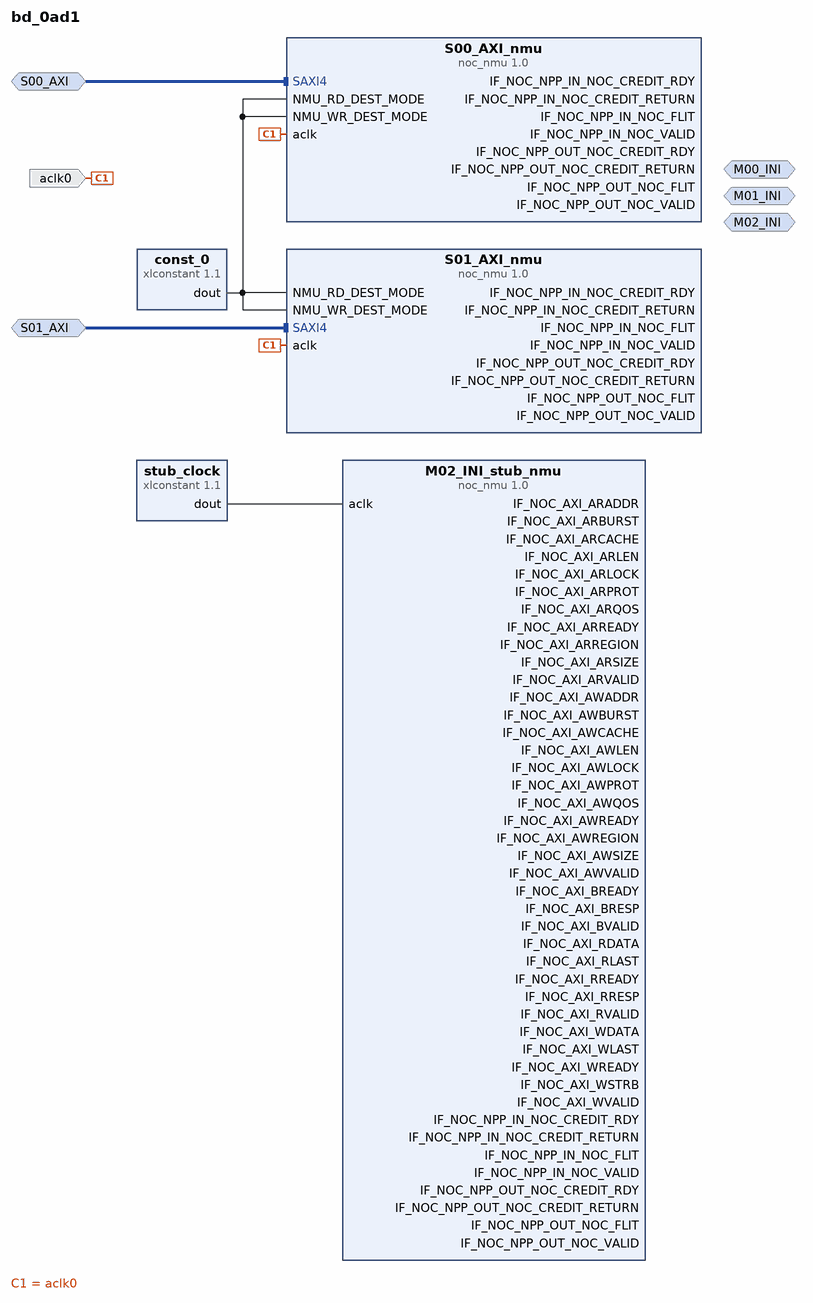
[diagram p0: block diagram of the top level]
# Vivado block design bd_0ad1, xcvc1902-vsvd1760-2MP-e-S, Vivado 2022.2.2
create_bd_design bd_0ad1

create_bd_intf_port -mode Slave -vlnv xilinx.com:interface:aximm_rtl:1.0 S00_AXI
set_property -dict [list \
  CONFIG.CATEGORY pl \
  CONFIG.CONNECTIONS {M00_INI {read_bw {819} write_bw {614} read_avg_burst {4} write_avg_burst {4}}} \
] [get_bd_intf_ports S00_AXI]
create_bd_intf_port -mode Slave -vlnv xilinx.com:interface:aximm_rtl:1.0 S01_AXI
set_property -dict [list \
  CONFIG.CATEGORY pl \
  CONFIG.CONNECTIONS {M01_INI {read_bw {778} write_bw {389} read_avg_burst {8} write_avg_burst {8}}} \
] [get_bd_intf_ports S01_AXI]
create_bd_intf_port -mode Master -vlnv xilinx.com:interface:inimm_rtl:1.0 M00_INI
set_property -dict {CONFIG.INI_STRATEGY load} [get_bd_intf_ports M00_INI]
create_bd_intf_port -mode Master -vlnv xilinx.com:interface:inimm_rtl:1.0 M01_INI
set_property -dict {CONFIG.INI_STRATEGY load} [get_bd_intf_ports M01_INI]
create_bd_intf_port -mode Master -vlnv xilinx.com:interface:inimm_rtl:1.0 M02_INI
set_property -dict {CONFIG.INI_STRATEGY load} [get_bd_intf_ports M02_INI]
create_bd_port -dir I -type clk aclk0
set_property -dict {CONFIG.ASSOCIATED_BUSIF S00_AXI:S01_AXI} [get_bd_ports aclk0]

create_bd_cell -type ip -vlnv xilinx.com:ip:noc_nmu:1.0 M02_INI_stub_nmu
set_property -dict {CONFIG.ATTR_FILE nocattrs.dat} [get_bd_cells M02_INI_stub_nmu]
create_bd_cell -type ip -vlnv xilinx.com:ip:noc_nmu:1.0 S00_AXI_nmu
set_property -dict [list \
  CONFIG.ATTR_FILE nocattrs.dat \
  CONFIG.USER_NOC_CATEGORY PL \
  CONFIG.USER_NOC_DATA512_WIDTH 128 \
  CONFIG.USER_NOC_NMU_WIDTH 512 \
] [get_bd_cells S00_AXI_nmu]
create_bd_cell -type ip -vlnv xilinx.com:ip:xlconstant:1.1 const_0
set_property -dict {CONFIG.CONST_VAL 0 CONFIG.CONST_WIDTH 1} [get_bd_cells const_0]
create_bd_cell -type ip -vlnv xilinx.com:ip:noc_nmu:1.0 S01_AXI_nmu
set_property -dict [list \
  CONFIG.ATTR_FILE nocattrs.dat \
  CONFIG.USER_NOC_CATEGORY PL \
  CONFIG.USER_NOC_DATA512_WIDTH 32 \
  CONFIG.USER_NOC_NMU_WIDTH 512 \
] [get_bd_cells S01_AXI_nmu]
create_bd_cell -type ip -vlnv xilinx.com:ip:xlconstant:1.1 stub_clock

# ---- connections ----

connect_bd_intf_net [get_bd_intf_ports S00_AXI] [get_bd_intf_pins S00_AXI_nmu/SAXI4]
connect_bd_intf_net [get_bd_intf_ports S01_AXI] [get_bd_intf_pins S01_AXI_nmu/SAXI4]
connect_bd_net -net aclk0_1 [get_bd_ports aclk0] [get_bd_pins S00_AXI_nmu/aclk] [get_bd_pins S01_AXI_nmu/aclk]
connect_bd_net [get_bd_pins const_0/dout] \
  [get_bd_pins S00_AXI_nmu/NMU_RD_DEST_MODE] [get_bd_pins S00_AXI_nmu/NMU_WR_DEST_MODE] \
  [get_bd_pins S01_AXI_nmu/NMU_RD_DEST_MODE] [get_bd_pins S01_AXI_nmu/NMU_WR_DEST_MODE]
# net m02_ini_stub_nmu_if_noc_axi_araddr has one end: M02_INI_stub_nmu/IF_NOC_AXI_ARADDR
# net m02_ini_stub_nmu_if_noc_axi_arburst has one end: M02_INI_stub_nmu/IF_NOC_AXI_ARBURST
# net m02_ini_stub_nmu_if_noc_axi_arcache has one end: M02_INI_stub_nmu/IF_NOC_AXI_ARCACHE
# net m02_ini_stub_nmu_if_noc_axi_arlen has one end: M02_INI_stub_nmu/IF_NOC_AXI_ARLEN
# net m02_ini_stub_nmu_if_noc_axi_arlock has one end: M02_INI_stub_nmu/IF_NOC_AXI_ARLOCK
# net m02_ini_stub_nmu_if_noc_axi_arprot has one end: M02_INI_stub_nmu/IF_NOC_AXI_ARPROT
# net m02_ini_stub_nmu_if_noc_axi_arqos has one end: M02_INI_stub_nmu/IF_NOC_AXI_ARQOS
# net m02_ini_stub_nmu_if_noc_axi_arready has one end: M02_INI_stub_nmu/IF_NOC_AXI_ARREADY
# net m02_ini_stub_nmu_if_noc_axi_arregion has one end: M02_INI_stub_nmu/IF_NOC_AXI_ARREGION
# net m02_ini_stub_nmu_if_noc_axi_arsize has one end: M02_INI_stub_nmu/IF_NOC_AXI_ARSIZE
# net m02_ini_stub_nmu_if_noc_axi_arvalid has one end: M02_INI_stub_nmu/IF_NOC_AXI_ARVALID
# net m02_ini_stub_nmu_if_noc_axi_awaddr has one end: M02_INI_stub_nmu/IF_NOC_AXI_AWADDR
# net m02_ini_stub_nmu_if_noc_axi_awburst has one end: M02_INI_stub_nmu/IF_NOC_AXI_AWBURST
# net m02_ini_stub_nmu_if_noc_axi_awcache has one end: M02_INI_stub_nmu/IF_NOC_AXI_AWCACHE
# net m02_ini_stub_nmu_if_noc_axi_awlen has one end: M02_INI_stub_nmu/IF_NOC_AXI_AWLEN
# net m02_ini_stub_nmu_if_noc_axi_awlock has one end: M02_INI_stub_nmu/IF_NOC_AXI_AWLOCK
# net m02_ini_stub_nmu_if_noc_axi_awprot has one end: M02_INI_stub_nmu/IF_NOC_AXI_AWPROT
# net m02_ini_stub_nmu_if_noc_axi_awqos has one end: M02_INI_stub_nmu/IF_NOC_AXI_AWQOS
# net m02_ini_stub_nmu_if_noc_axi_awready has one end: M02_INI_stub_nmu/IF_NOC_AXI_AWREADY
# net m02_ini_stub_nmu_if_noc_axi_awregion has one end: M02_INI_stub_nmu/IF_NOC_AXI_AWREGION
# net m02_ini_stub_nmu_if_noc_axi_awsize has one end: M02_INI_stub_nmu/IF_NOC_AXI_AWSIZE
# net m02_ini_stub_nmu_if_noc_axi_awvalid has one end: M02_INI_stub_nmu/IF_NOC_AXI_AWVALID
# net m02_ini_stub_nmu_if_noc_axi_bready has one end: M02_INI_stub_nmu/IF_NOC_AXI_BREADY
# net m02_ini_stub_nmu_if_noc_axi_bresp has one end: M02_INI_stub_nmu/IF_NOC_AXI_BRESP
# net m02_ini_stub_nmu_if_noc_axi_bvalid has one end: M02_INI_stub_nmu/IF_NOC_AXI_BVALID
# net m02_ini_stub_nmu_if_noc_axi_rdata has one end: M02_INI_stub_nmu/IF_NOC_AXI_RDATA
# net m02_ini_stub_nmu_if_noc_axi_rlast has one end: M02_INI_stub_nmu/IF_NOC_AXI_RLAST
# net m02_ini_stub_nmu_if_noc_axi_rready has one end: M02_INI_stub_nmu/IF_NOC_AXI_RREADY
# net m02_ini_stub_nmu_if_noc_axi_rresp has one end: M02_INI_stub_nmu/IF_NOC_AXI_RRESP
# net m02_ini_stub_nmu_if_noc_axi_rvalid has one end: M02_INI_stub_nmu/IF_NOC_AXI_RVALID
# net m02_ini_stub_nmu_if_noc_axi_wdata has one end: M02_INI_stub_nmu/IF_NOC_AXI_WDATA
# net m02_ini_stub_nmu_if_noc_axi_wlast has one end: M02_INI_stub_nmu/IF_NOC_AXI_WLAST
# net m02_ini_stub_nmu_if_noc_axi_wready has one end: M02_INI_stub_nmu/IF_NOC_AXI_WREADY
# net m02_ini_stub_nmu_if_noc_axi_wstrb has one end: M02_INI_stub_nmu/IF_NOC_AXI_WSTRB
# net m02_ini_stub_nmu_if_noc_axi_wvalid has one end: M02_INI_stub_nmu/IF_NOC_AXI_WVALID
# net m02_ini_stub_nmu_if_noc_npp_in_noc_credit_rdy has one end: M02_INI_stub_nmu/IF_NOC_NPP_IN_NOC_CREDIT_RDY
# net m02_ini_stub_nmu_if_noc_npp_in_noc_credit_return has one end: M02_INI_stub_nmu/IF_NOC_NPP_IN_NOC_CREDIT_RETURN
# net m02_ini_stub_nmu_if_noc_npp_in_noc_flit has one end: M02_INI_stub_nmu/IF_NOC_NPP_IN_NOC_FLIT
# net m02_ini_stub_nmu_if_noc_npp_in_noc_valid has one end: M02_INI_stub_nmu/IF_NOC_NPP_IN_NOC_VALID
# net m02_ini_stub_nmu_if_noc_npp_out_noc_credit_rdy has one end: M02_INI_stub_nmu/IF_NOC_NPP_OUT_NOC_CREDIT_RDY
# net m02_ini_stub_nmu_if_noc_npp_out_noc_credit_return has one end: M02_INI_stub_nmu/IF_NOC_NPP_OUT_NOC_CREDIT_RETURN
# net m02_ini_stub_nmu_if_noc_npp_out_noc_flit has one end: M02_INI_stub_nmu/IF_NOC_NPP_OUT_NOC_FLIT
# net m02_ini_stub_nmu_if_noc_npp_out_noc_valid has one end: M02_INI_stub_nmu/IF_NOC_NPP_OUT_NOC_VALID
# net s00_axi_nmu_if_noc_npp_in_noc_credit_rdy has one end: S00_AXI_nmu/IF_NOC_NPP_IN_NOC_CREDIT_RDY
# net s00_axi_nmu_if_noc_npp_in_noc_credit_return has one end: S00_AXI_nmu/IF_NOC_NPP_IN_NOC_CREDIT_RETURN
# net s00_axi_nmu_if_noc_npp_in_noc_flit has one end: S00_AXI_nmu/IF_NOC_NPP_IN_NOC_FLIT
# net s00_axi_nmu_if_noc_npp_in_noc_valid has one end: S00_AXI_nmu/IF_NOC_NPP_IN_NOC_VALID
# net s00_axi_nmu_if_noc_npp_out_noc_credit_rdy has one end: S00_AXI_nmu/IF_NOC_NPP_OUT_NOC_CREDIT_RDY
# net s00_axi_nmu_if_noc_npp_out_noc_credit_return has one end: S00_AXI_nmu/IF_NOC_NPP_OUT_NOC_CREDIT_RETURN
# net s00_axi_nmu_if_noc_npp_out_noc_flit has one end: S00_AXI_nmu/IF_NOC_NPP_OUT_NOC_FLIT
# net s00_axi_nmu_if_noc_npp_out_noc_valid has one end: S00_AXI_nmu/IF_NOC_NPP_OUT_NOC_VALID
# net s01_axi_nmu_if_noc_npp_in_noc_credit_rdy has one end: S01_AXI_nmu/IF_NOC_NPP_IN_NOC_CREDIT_RDY
# net s01_axi_nmu_if_noc_npp_in_noc_credit_return has one end: S01_AXI_nmu/IF_NOC_NPP_IN_NOC_CREDIT_RETURN
# net s01_axi_nmu_if_noc_npp_in_noc_flit has one end: S01_AXI_nmu/IF_NOC_NPP_IN_NOC_FLIT
# net s01_axi_nmu_if_noc_npp_in_noc_valid has one end: S01_AXI_nmu/IF_NOC_NPP_IN_NOC_VALID
# net s01_axi_nmu_if_noc_npp_out_noc_credit_rdy has one end: S01_AXI_nmu/IF_NOC_NPP_OUT_NOC_CREDIT_RDY
# net s01_axi_nmu_if_noc_npp_out_noc_credit_return has one end: S01_AXI_nmu/IF_NOC_NPP_OUT_NOC_CREDIT_RETURN
# net s01_axi_nmu_if_noc_npp_out_noc_flit has one end: S01_AXI_nmu/IF_NOC_NPP_OUT_NOC_FLIT
# net s01_axi_nmu_if_noc_npp_out_noc_valid has one end: S01_AXI_nmu/IF_NOC_NPP_OUT_NOC_VALID
connect_bd_net [get_bd_pins stub_clock/dout] [get_bd_pins M02_INI_stub_nmu/aclk]
set_property HDL_ATTRIBUTE.DONT_TOUCH true [get_bd_cells M02_INI_stub_nmu]
set_property HDL_ATTRIBUTE.DONT_TOUCH true [get_bd_cells S00_AXI_nmu]
set_property HDL_ATTRIBUTE.DONT_TOUCH true [get_bd_cells const_0]
set_property HDL_ATTRIBUTE.DONT_TOUCH true [get_bd_cells S01_AXI_nmu]
set_property HDL_ATTRIBUTE.DONT_TOUCH true [get_bd_cells stub_clock]
set_property HDL_ATTRIBUTE.EXT_CONN TRUE [get_bd_nets m02_ini_stub_nmu_if_noc_axi_araddr]
set_property HDL_ATTRIBUTE.HIDDEN TRUE [get_bd_nets m02_ini_stub_nmu_if_noc_axi_araddr]
set_property HDL_ATTRIBUTE.SIM_ONLY TRUE [get_bd_nets m02_ini_stub_nmu_if_noc_axi_araddr]
set_property HDL_ATTRIBUTE.EXT_CONN TRUE [get_bd_nets m02_ini_stub_nmu_if_noc_axi_arburst]
set_property HDL_ATTRIBUTE.HIDDEN TRUE [get_bd_nets m02_ini_stub_nmu_if_noc_axi_arburst]
set_property HDL_ATTRIBUTE.SIM_ONLY TRUE [get_bd_nets m02_ini_stub_nmu_if_noc_axi_arburst]
set_property HDL_ATTRIBUTE.EXT_CONN TRUE [get_bd_nets m02_ini_stub_nmu_if_noc_axi_arcache]
set_property HDL_ATTRIBUTE.HIDDEN TRUE [get_bd_nets m02_ini_stub_nmu_if_noc_axi_arcache]
set_property HDL_ATTRIBUTE.SIM_ONLY TRUE [get_bd_nets m02_ini_stub_nmu_if_noc_axi_arcache]
set_property HDL_ATTRIBUTE.EXT_CONN TRUE [get_bd_nets m02_ini_stub_nmu_if_noc_axi_arlen]
set_property HDL_ATTRIBUTE.HIDDEN TRUE [get_bd_nets m02_ini_stub_nmu_if_noc_axi_arlen]
set_property HDL_ATTRIBUTE.SIM_ONLY TRUE [get_bd_nets m02_ini_stub_nmu_if_noc_axi_arlen]
set_property HDL_ATTRIBUTE.EXT_CONN TRUE [get_bd_nets m02_ini_stub_nmu_if_noc_axi_arlock]
set_property HDL_ATTRIBUTE.HIDDEN TRUE [get_bd_nets m02_ini_stub_nmu_if_noc_axi_arlock]
set_property HDL_ATTRIBUTE.SIM_ONLY TRUE [get_bd_nets m02_ini_stub_nmu_if_noc_axi_arlock]
set_property HDL_ATTRIBUTE.EXT_CONN TRUE [get_bd_nets m02_ini_stub_nmu_if_noc_axi_arprot]
set_property HDL_ATTRIBUTE.HIDDEN TRUE [get_bd_nets m02_ini_stub_nmu_if_noc_axi_arprot]
set_property HDL_ATTRIBUTE.SIM_ONLY TRUE [get_bd_nets m02_ini_stub_nmu_if_noc_axi_arprot]
set_property HDL_ATTRIBUTE.EXT_CONN TRUE [get_bd_nets m02_ini_stub_nmu_if_noc_axi_arqos]
set_property HDL_ATTRIBUTE.HIDDEN TRUE [get_bd_nets m02_ini_stub_nmu_if_noc_axi_arqos]
set_property HDL_ATTRIBUTE.SIM_ONLY TRUE [get_bd_nets m02_ini_stub_nmu_if_noc_axi_arqos]
set_property HDL_ATTRIBUTE.EXT_CONN TRUE [get_bd_nets m02_ini_stub_nmu_if_noc_axi_arready]
set_property HDL_ATTRIBUTE.HIDDEN TRUE [get_bd_nets m02_ini_stub_nmu_if_noc_axi_arready]
set_property HDL_ATTRIBUTE.SIM_ONLY TRUE [get_bd_nets m02_ini_stub_nmu_if_noc_axi_arready]
set_property HDL_ATTRIBUTE.EXT_CONN TRUE [get_bd_nets m02_ini_stub_nmu_if_noc_axi_arregion]
set_property HDL_ATTRIBUTE.HIDDEN TRUE [get_bd_nets m02_ini_stub_nmu_if_noc_axi_arregion]
set_property HDL_ATTRIBUTE.SIM_ONLY TRUE [get_bd_nets m02_ini_stub_nmu_if_noc_axi_arregion]
set_property HDL_ATTRIBUTE.EXT_CONN TRUE [get_bd_nets m02_ini_stub_nmu_if_noc_axi_arsize]
set_property HDL_ATTRIBUTE.HIDDEN TRUE [get_bd_nets m02_ini_stub_nmu_if_noc_axi_arsize]
set_property HDL_ATTRIBUTE.SIM_ONLY TRUE [get_bd_nets m02_ini_stub_nmu_if_noc_axi_arsize]
set_property HDL_ATTRIBUTE.EXT_CONN TRUE [get_bd_nets m02_ini_stub_nmu_if_noc_axi_arvalid]
set_property HDL_ATTRIBUTE.HIDDEN TRUE [get_bd_nets m02_ini_stub_nmu_if_noc_axi_arvalid]
set_property HDL_ATTRIBUTE.SIM_ONLY TRUE [get_bd_nets m02_ini_stub_nmu_if_noc_axi_arvalid]
set_property HDL_ATTRIBUTE.EXT_CONN TRUE [get_bd_nets m02_ini_stub_nmu_if_noc_axi_awaddr]
set_property HDL_ATTRIBUTE.HIDDEN TRUE [get_bd_nets m02_ini_stub_nmu_if_noc_axi_awaddr]
set_property HDL_ATTRIBUTE.SIM_ONLY TRUE [get_bd_nets m02_ini_stub_nmu_if_noc_axi_awaddr]
set_property HDL_ATTRIBUTE.EXT_CONN TRUE [get_bd_nets m02_ini_stub_nmu_if_noc_axi_awburst]
set_property HDL_ATTRIBUTE.HIDDEN TRUE [get_bd_nets m02_ini_stub_nmu_if_noc_axi_awburst]
set_property HDL_ATTRIBUTE.SIM_ONLY TRUE [get_bd_nets m02_ini_stub_nmu_if_noc_axi_awburst]
set_property HDL_ATTRIBUTE.EXT_CONN TRUE [get_bd_nets m02_ini_stub_nmu_if_noc_axi_awcache]
set_property HDL_ATTRIBUTE.HIDDEN TRUE [get_bd_nets m02_ini_stub_nmu_if_noc_axi_awcache]
set_property HDL_ATTRIBUTE.SIM_ONLY TRUE [get_bd_nets m02_ini_stub_nmu_if_noc_axi_awcache]
set_property HDL_ATTRIBUTE.EXT_CONN TRUE [get_bd_nets m02_ini_stub_nmu_if_noc_axi_awlen]
set_property HDL_ATTRIBUTE.HIDDEN TRUE [get_bd_nets m02_ini_stub_nmu_if_noc_axi_awlen]
set_property HDL_ATTRIBUTE.SIM_ONLY TRUE [get_bd_nets m02_ini_stub_nmu_if_noc_axi_awlen]
set_property HDL_ATTRIBUTE.EXT_CONN TRUE [get_bd_nets m02_ini_stub_nmu_if_noc_axi_awlock]
set_property HDL_ATTRIBUTE.HIDDEN TRUE [get_bd_nets m02_ini_stub_nmu_if_noc_axi_awlock]
set_property HDL_ATTRIBUTE.SIM_ONLY TRUE [get_bd_nets m02_ini_stub_nmu_if_noc_axi_awlock]
set_property HDL_ATTRIBUTE.EXT_CONN TRUE [get_bd_nets m02_ini_stub_nmu_if_noc_axi_awprot]
set_property HDL_ATTRIBUTE.HIDDEN TRUE [get_bd_nets m02_ini_stub_nmu_if_noc_axi_awprot]
set_property HDL_ATTRIBUTE.SIM_ONLY TRUE [get_bd_nets m02_ini_stub_nmu_if_noc_axi_awprot]
set_property HDL_ATTRIBUTE.EXT_CONN TRUE [get_bd_nets m02_ini_stub_nmu_if_noc_axi_awqos]
set_property HDL_ATTRIBUTE.HIDDEN TRUE [get_bd_nets m02_ini_stub_nmu_if_noc_axi_awqos]
set_property HDL_ATTRIBUTE.SIM_ONLY TRUE [get_bd_nets m02_ini_stub_nmu_if_noc_axi_awqos]
set_property HDL_ATTRIBUTE.EXT_CONN TRUE [get_bd_nets m02_ini_stub_nmu_if_noc_axi_awready]
set_property HDL_ATTRIBUTE.HIDDEN TRUE [get_bd_nets m02_ini_stub_nmu_if_noc_axi_awready]
set_property HDL_ATTRIBUTE.SIM_ONLY TRUE [get_bd_nets m02_ini_stub_nmu_if_noc_axi_awready]
set_property HDL_ATTRIBUTE.EXT_CONN TRUE [get_bd_nets m02_ini_stub_nmu_if_noc_axi_awregion]
set_property HDL_ATTRIBUTE.HIDDEN TRUE [get_bd_nets m02_ini_stub_nmu_if_noc_axi_awregion]
set_property HDL_ATTRIBUTE.SIM_ONLY TRUE [get_bd_nets m02_ini_stub_nmu_if_noc_axi_awregion]
set_property HDL_ATTRIBUTE.EXT_CONN TRUE [get_bd_nets m02_ini_stub_nmu_if_noc_axi_awsize]
set_property HDL_ATTRIBUTE.HIDDEN TRUE [get_bd_nets m02_ini_stub_nmu_if_noc_axi_awsize]
set_property HDL_ATTRIBUTE.SIM_ONLY TRUE [get_bd_nets m02_ini_stub_nmu_if_noc_axi_awsize]
set_property HDL_ATTRIBUTE.EXT_CONN TRUE [get_bd_nets m02_ini_stub_nmu_if_noc_axi_awvalid]
set_property HDL_ATTRIBUTE.HIDDEN TRUE [get_bd_nets m02_ini_stub_nmu_if_noc_axi_awvalid]
set_property HDL_ATTRIBUTE.SIM_ONLY TRUE [get_bd_nets m02_ini_stub_nmu_if_noc_axi_awvalid]
set_property HDL_ATTRIBUTE.EXT_CONN TRUE [get_bd_nets m02_ini_stub_nmu_if_noc_axi_bready]
set_property HDL_ATTRIBUTE.HIDDEN TRUE [get_bd_nets m02_ini_stub_nmu_if_noc_axi_bready]
set_property HDL_ATTRIBUTE.SIM_ONLY TRUE [get_bd_nets m02_ini_stub_nmu_if_noc_axi_bready]
set_property HDL_ATTRIBUTE.EXT_CONN TRUE [get_bd_nets m02_ini_stub_nmu_if_noc_axi_bresp]
set_property HDL_ATTRIBUTE.HIDDEN TRUE [get_bd_nets m02_ini_stub_nmu_if_noc_axi_bresp]
set_property HDL_ATTRIBUTE.SIM_ONLY TRUE [get_bd_nets m02_ini_stub_nmu_if_noc_axi_bresp]
set_property HDL_ATTRIBUTE.EXT_CONN TRUE [get_bd_nets m02_ini_stub_nmu_if_noc_axi_bvalid]
set_property HDL_ATTRIBUTE.HIDDEN TRUE [get_bd_nets m02_ini_stub_nmu_if_noc_axi_bvalid]
set_property HDL_ATTRIBUTE.SIM_ONLY TRUE [get_bd_nets m02_ini_stub_nmu_if_noc_axi_bvalid]
set_property HDL_ATTRIBUTE.EXT_CONN TRUE [get_bd_nets m02_ini_stub_nmu_if_noc_axi_rdata]
set_property HDL_ATTRIBUTE.HIDDEN TRUE [get_bd_nets m02_ini_stub_nmu_if_noc_axi_rdata]
set_property HDL_ATTRIBUTE.SIM_ONLY TRUE [get_bd_nets m02_ini_stub_nmu_if_noc_axi_rdata]
set_property HDL_ATTRIBUTE.EXT_CONN TRUE [get_bd_nets m02_ini_stub_nmu_if_noc_axi_rlast]
set_property HDL_ATTRIBUTE.HIDDEN TRUE [get_bd_nets m02_ini_stub_nmu_if_noc_axi_rlast]
set_property HDL_ATTRIBUTE.SIM_ONLY TRUE [get_bd_nets m02_ini_stub_nmu_if_noc_axi_rlast]
set_property HDL_ATTRIBUTE.EXT_CONN TRUE [get_bd_nets m02_ini_stub_nmu_if_noc_axi_rready]
set_property HDL_ATTRIBUTE.HIDDEN TRUE [get_bd_nets m02_ini_stub_nmu_if_noc_axi_rready]
set_property HDL_ATTRIBUTE.SIM_ONLY TRUE [get_bd_nets m02_ini_stub_nmu_if_noc_axi_rready]
set_property HDL_ATTRIBUTE.EXT_CONN TRUE [get_bd_nets m02_ini_stub_nmu_if_noc_axi_rresp]
set_property HDL_ATTRIBUTE.HIDDEN TRUE [get_bd_nets m02_ini_stub_nmu_if_noc_axi_rresp]
set_property HDL_ATTRIBUTE.SIM_ONLY TRUE [get_bd_nets m02_ini_stub_nmu_if_noc_axi_rresp]
set_property HDL_ATTRIBUTE.EXT_CONN TRUE [get_bd_nets m02_ini_stub_nmu_if_noc_axi_rvalid]
set_property HDL_ATTRIBUTE.HIDDEN TRUE [get_bd_nets m02_ini_stub_nmu_if_noc_axi_rvalid]
set_property HDL_ATTRIBUTE.SIM_ONLY TRUE [get_bd_nets m02_ini_stub_nmu_if_noc_axi_rvalid]
set_property HDL_ATTRIBUTE.EXT_CONN TRUE [get_bd_nets m02_ini_stub_nmu_if_noc_axi_wdata]
set_property HDL_ATTRIBUTE.HIDDEN TRUE [get_bd_nets m02_ini_stub_nmu_if_noc_axi_wdata]
set_property HDL_ATTRIBUTE.SIM_ONLY TRUE [get_bd_nets m02_ini_stub_nmu_if_noc_axi_wdata]
set_property HDL_ATTRIBUTE.EXT_CONN TRUE [get_bd_nets m02_ini_stub_nmu_if_noc_axi_wlast]
set_property HDL_ATTRIBUTE.HIDDEN TRUE [get_bd_nets m02_ini_stub_nmu_if_noc_axi_wlast]
set_property HDL_ATTRIBUTE.SIM_ONLY TRUE [get_bd_nets m02_ini_stub_nmu_if_noc_axi_wlast]
set_property HDL_ATTRIBUTE.EXT_CONN TRUE [get_bd_nets m02_ini_stub_nmu_if_noc_axi_wready]
set_property HDL_ATTRIBUTE.HIDDEN TRUE [get_bd_nets m02_ini_stub_nmu_if_noc_axi_wready]
set_property HDL_ATTRIBUTE.SIM_ONLY TRUE [get_bd_nets m02_ini_stub_nmu_if_noc_axi_wready]
set_property HDL_ATTRIBUTE.EXT_CONN TRUE [get_bd_nets m02_ini_stub_nmu_if_noc_axi_wstrb]
set_property HDL_ATTRIBUTE.HIDDEN TRUE [get_bd_nets m02_ini_stub_nmu_if_noc_axi_wstrb]
set_property HDL_ATTRIBUTE.SIM_ONLY TRUE [get_bd_nets m02_ini_stub_nmu_if_noc_axi_wstrb]
set_property HDL_ATTRIBUTE.EXT_CONN TRUE [get_bd_nets m02_ini_stub_nmu_if_noc_axi_wvalid]
set_property HDL_ATTRIBUTE.HIDDEN TRUE [get_bd_nets m02_ini_stub_nmu_if_noc_axi_wvalid]
set_property HDL_ATTRIBUTE.SIM_ONLY TRUE [get_bd_nets m02_ini_stub_nmu_if_noc_axi_wvalid]
set_property HDL_ATTRIBUTE.EXT_CONN TRUE [get_bd_nets m02_ini_stub_nmu_if_noc_npp_in_noc_credit_rdy]
set_property HDL_ATTRIBUTE.HIDDEN TRUE [get_bd_nets m02_ini_stub_nmu_if_noc_npp_in_noc_credit_rdy]
set_property HDL_ATTRIBUTE.SIM_ONLY TRUE [get_bd_nets m02_ini_stub_nmu_if_noc_npp_in_noc_credit_rdy]
set_property HDL_ATTRIBUTE.EXT_CONN TRUE [get_bd_nets m02_ini_stub_nmu_if_noc_npp_in_noc_credit_return]
set_property HDL_ATTRIBUTE.HIDDEN TRUE [get_bd_nets m02_ini_stub_nmu_if_noc_npp_in_noc_credit_return]
set_property HDL_ATTRIBUTE.SIM_ONLY TRUE [get_bd_nets m02_ini_stub_nmu_if_noc_npp_in_noc_credit_return]
set_property HDL_ATTRIBUTE.EXT_CONN TRUE [get_bd_nets m02_ini_stub_nmu_if_noc_npp_in_noc_flit]
set_property HDL_ATTRIBUTE.HIDDEN TRUE [get_bd_nets m02_ini_stub_nmu_if_noc_npp_in_noc_flit]
set_property HDL_ATTRIBUTE.SIM_ONLY TRUE [get_bd_nets m02_ini_stub_nmu_if_noc_npp_in_noc_flit]
set_property HDL_ATTRIBUTE.EXT_CONN TRUE [get_bd_nets m02_ini_stub_nmu_if_noc_npp_in_noc_valid]
set_property HDL_ATTRIBUTE.HIDDEN TRUE [get_bd_nets m02_ini_stub_nmu_if_noc_npp_in_noc_valid]
set_property HDL_ATTRIBUTE.SIM_ONLY TRUE [get_bd_nets m02_ini_stub_nmu_if_noc_npp_in_noc_valid]
set_property HDL_ATTRIBUTE.EXT_CONN TRUE [get_bd_nets m02_ini_stub_nmu_if_noc_npp_out_noc_credit_rdy]
set_property HDL_ATTRIBUTE.HIDDEN TRUE [get_bd_nets m02_ini_stub_nmu_if_noc_npp_out_noc_credit_rdy]
set_property HDL_ATTRIBUTE.SIM_ONLY TRUE [get_bd_nets m02_ini_stub_nmu_if_noc_npp_out_noc_credit_rdy]
set_property HDL_ATTRIBUTE.EXT_CONN TRUE [get_bd_nets m02_ini_stub_nmu_if_noc_npp_out_noc_credit_return]
set_property HDL_ATTRIBUTE.HIDDEN TRUE [get_bd_nets m02_ini_stub_nmu_if_noc_npp_out_noc_credit_return]
set_property HDL_ATTRIBUTE.SIM_ONLY TRUE [get_bd_nets m02_ini_stub_nmu_if_noc_npp_out_noc_credit_return]
set_property HDL_ATTRIBUTE.EXT_CONN TRUE [get_bd_nets m02_ini_stub_nmu_if_noc_npp_out_noc_flit]
set_property HDL_ATTRIBUTE.HIDDEN TRUE [get_bd_nets m02_ini_stub_nmu_if_noc_npp_out_noc_flit]
set_property HDL_ATTRIBUTE.SIM_ONLY TRUE [get_bd_nets m02_ini_stub_nmu_if_noc_npp_out_noc_flit]
set_property HDL_ATTRIBUTE.EXT_CONN TRUE [get_bd_nets m02_ini_stub_nmu_if_noc_npp_out_noc_valid]
set_property HDL_ATTRIBUTE.HIDDEN TRUE [get_bd_nets m02_ini_stub_nmu_if_noc_npp_out_noc_valid]
set_property HDL_ATTRIBUTE.SIM_ONLY TRUE [get_bd_nets m02_ini_stub_nmu_if_noc_npp_out_noc_valid]
set_property HDL_ATTRIBUTE.EXT_CONN TRUE [get_bd_nets s00_axi_nmu_if_noc_npp_in_noc_credit_rdy]
set_property HDL_ATTRIBUTE.HIDDEN TRUE [get_bd_nets s00_axi_nmu_if_noc_npp_in_noc_credit_rdy]
set_property HDL_ATTRIBUTE.SIM_ONLY TRUE [get_bd_nets s00_axi_nmu_if_noc_npp_in_noc_credit_rdy]
set_property HDL_ATTRIBUTE.EXT_CONN TRUE [get_bd_nets s00_axi_nmu_if_noc_npp_in_noc_credit_return]
set_property HDL_ATTRIBUTE.HIDDEN TRUE [get_bd_nets s00_axi_nmu_if_noc_npp_in_noc_credit_return]
set_property HDL_ATTRIBUTE.SIM_ONLY TRUE [get_bd_nets s00_axi_nmu_if_noc_npp_in_noc_credit_return]
set_property HDL_ATTRIBUTE.EXT_CONN TRUE [get_bd_nets s00_axi_nmu_if_noc_npp_in_noc_flit]
set_property HDL_ATTRIBUTE.HIDDEN TRUE [get_bd_nets s00_axi_nmu_if_noc_npp_in_noc_flit]
set_property HDL_ATTRIBUTE.SIM_ONLY TRUE [get_bd_nets s00_axi_nmu_if_noc_npp_in_noc_flit]
set_property HDL_ATTRIBUTE.EXT_CONN TRUE [get_bd_nets s00_axi_nmu_if_noc_npp_in_noc_valid]
set_property HDL_ATTRIBUTE.HIDDEN TRUE [get_bd_nets s00_axi_nmu_if_noc_npp_in_noc_valid]
set_property HDL_ATTRIBUTE.SIM_ONLY TRUE [get_bd_nets s00_axi_nmu_if_noc_npp_in_noc_valid]
set_property HDL_ATTRIBUTE.EXT_CONN TRUE [get_bd_nets s00_axi_nmu_if_noc_npp_out_noc_credit_rdy]
set_property HDL_ATTRIBUTE.HIDDEN TRUE [get_bd_nets s00_axi_nmu_if_noc_npp_out_noc_credit_rdy]
set_property HDL_ATTRIBUTE.SIM_ONLY TRUE [get_bd_nets s00_axi_nmu_if_noc_npp_out_noc_credit_rdy]
set_property HDL_ATTRIBUTE.EXT_CONN TRUE [get_bd_nets s00_axi_nmu_if_noc_npp_out_noc_credit_return]
set_property HDL_ATTRIBUTE.HIDDEN TRUE [get_bd_nets s00_axi_nmu_if_noc_npp_out_noc_credit_return]
set_property HDL_ATTRIBUTE.SIM_ONLY TRUE [get_bd_nets s00_axi_nmu_if_noc_npp_out_noc_credit_return]
set_property HDL_ATTRIBUTE.EXT_CONN TRUE [get_bd_nets s00_axi_nmu_if_noc_npp_out_noc_flit]
set_property HDL_ATTRIBUTE.HIDDEN TRUE [get_bd_nets s00_axi_nmu_if_noc_npp_out_noc_flit]
set_property HDL_ATTRIBUTE.SIM_ONLY TRUE [get_bd_nets s00_axi_nmu_if_noc_npp_out_noc_flit]
set_property HDL_ATTRIBUTE.EXT_CONN TRUE [get_bd_nets s00_axi_nmu_if_noc_npp_out_noc_valid]
set_property HDL_ATTRIBUTE.HIDDEN TRUE [get_bd_nets s00_axi_nmu_if_noc_npp_out_noc_valid]
set_property HDL_ATTRIBUTE.SIM_ONLY TRUE [get_bd_nets s00_axi_nmu_if_noc_npp_out_noc_valid]
set_property HDL_ATTRIBUTE.EXT_CONN TRUE [get_bd_nets s01_axi_nmu_if_noc_npp_in_noc_credit_rdy]
set_property HDL_ATTRIBUTE.HIDDEN TRUE [get_bd_nets s01_axi_nmu_if_noc_npp_in_noc_credit_rdy]
set_property HDL_ATTRIBUTE.SIM_ONLY TRUE [get_bd_nets s01_axi_nmu_if_noc_npp_in_noc_credit_rdy]
set_property HDL_ATTRIBUTE.EXT_CONN TRUE [get_bd_nets s01_axi_nmu_if_noc_npp_in_noc_credit_return]
set_property HDL_ATTRIBUTE.HIDDEN TRUE [get_bd_nets s01_axi_nmu_if_noc_npp_in_noc_credit_return]
set_property HDL_ATTRIBUTE.SIM_ONLY TRUE [get_bd_nets s01_axi_nmu_if_noc_npp_in_noc_credit_return]
set_property HDL_ATTRIBUTE.EXT_CONN TRUE [get_bd_nets s01_axi_nmu_if_noc_npp_in_noc_flit]
set_property HDL_ATTRIBUTE.HIDDEN TRUE [get_bd_nets s01_axi_nmu_if_noc_npp_in_noc_flit]
set_property HDL_ATTRIBUTE.SIM_ONLY TRUE [get_bd_nets s01_axi_nmu_if_noc_npp_in_noc_flit]
set_property HDL_ATTRIBUTE.EXT_CONN TRUE [get_bd_nets s01_axi_nmu_if_noc_npp_in_noc_valid]
set_property HDL_ATTRIBUTE.HIDDEN TRUE [get_bd_nets s01_axi_nmu_if_noc_npp_in_noc_valid]
set_property HDL_ATTRIBUTE.SIM_ONLY TRUE [get_bd_nets s01_axi_nmu_if_noc_npp_in_noc_valid]
set_property HDL_ATTRIBUTE.EXT_CONN TRUE [get_bd_nets s01_axi_nmu_if_noc_npp_out_noc_credit_rdy]
set_property HDL_ATTRIBUTE.HIDDEN TRUE [get_bd_nets s01_axi_nmu_if_noc_npp_out_noc_credit_rdy]
set_property HDL_ATTRIBUTE.SIM_ONLY TRUE [get_bd_nets s01_axi_nmu_if_noc_npp_out_noc_credit_rdy]
set_property HDL_ATTRIBUTE.EXT_CONN TRUE [get_bd_nets s01_axi_nmu_if_noc_npp_out_noc_credit_return]
set_property HDL_ATTRIBUTE.HIDDEN TRUE [get_bd_nets s01_axi_nmu_if_noc_npp_out_noc_credit_return]
set_property HDL_ATTRIBUTE.SIM_ONLY TRUE [get_bd_nets s01_axi_nmu_if_noc_npp_out_noc_credit_return]
set_property HDL_ATTRIBUTE.EXT_CONN TRUE [get_bd_nets s01_axi_nmu_if_noc_npp_out_noc_flit]
set_property HDL_ATTRIBUTE.HIDDEN TRUE [get_bd_nets s01_axi_nmu_if_noc_npp_out_noc_flit]
set_property HDL_ATTRIBUTE.SIM_ONLY TRUE [get_bd_nets s01_axi_nmu_if_noc_npp_out_noc_flit]
set_property HDL_ATTRIBUTE.EXT_CONN TRUE [get_bd_nets s01_axi_nmu_if_noc_npp_out_noc_valid]
set_property HDL_ATTRIBUTE.HIDDEN TRUE [get_bd_nets s01_axi_nmu_if_noc_npp_out_noc_valid]
set_property HDL_ATTRIBUTE.SIM_ONLY TRUE [get_bd_nets s01_axi_nmu_if_noc_npp_out_noc_valid]

validate_bd_design
save_bd_design
